# Altium schematic sheet Gate Driver HV.SchDoc
size A2
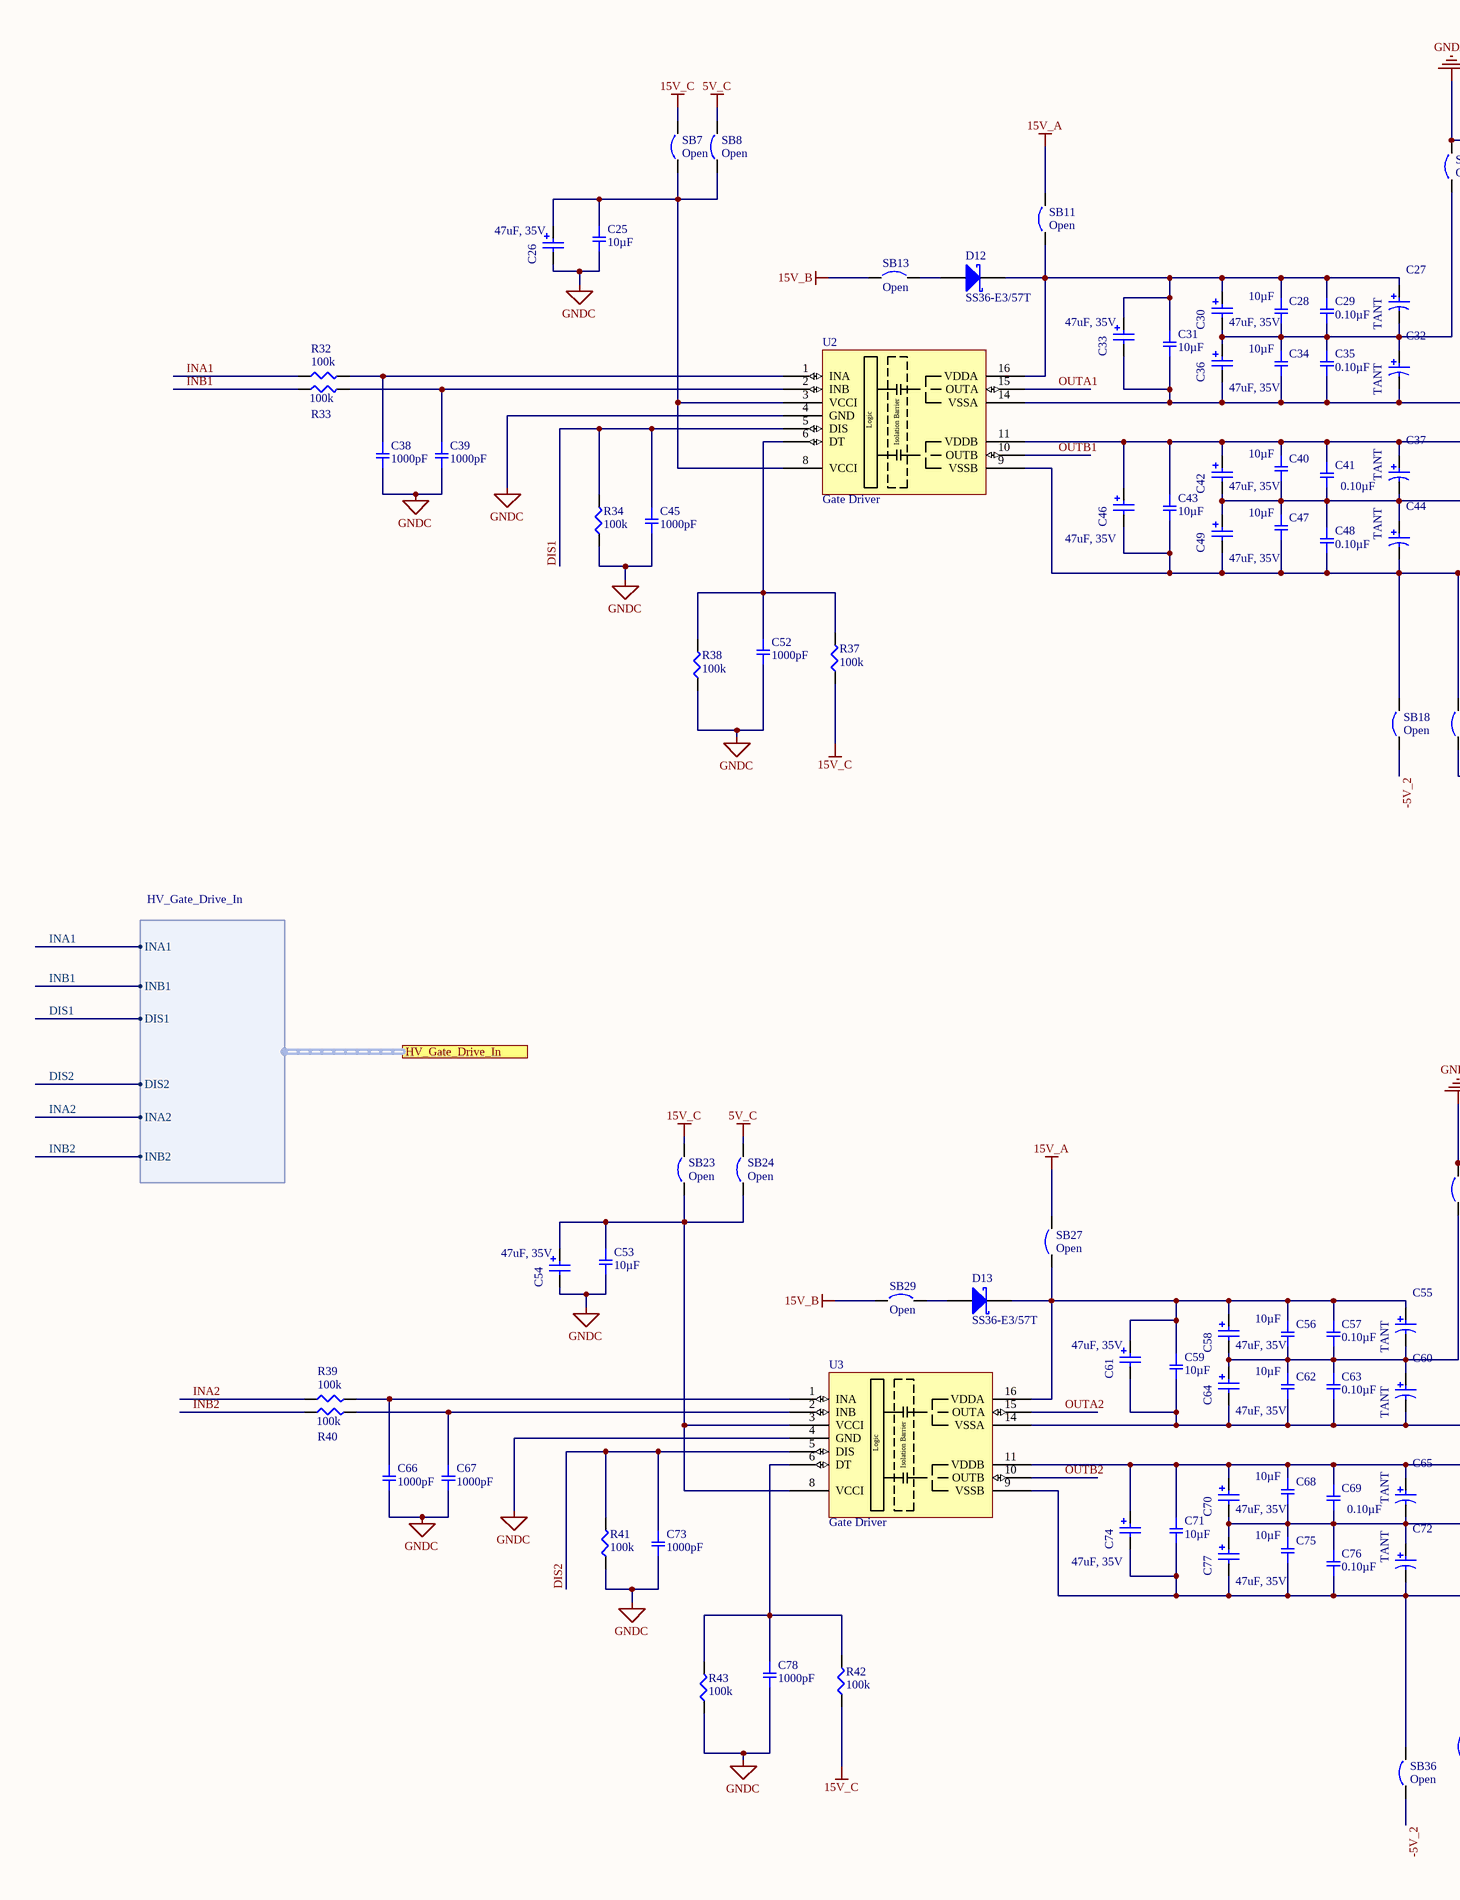
[diagram p0: Gate Driver HV.SchDoc, left]
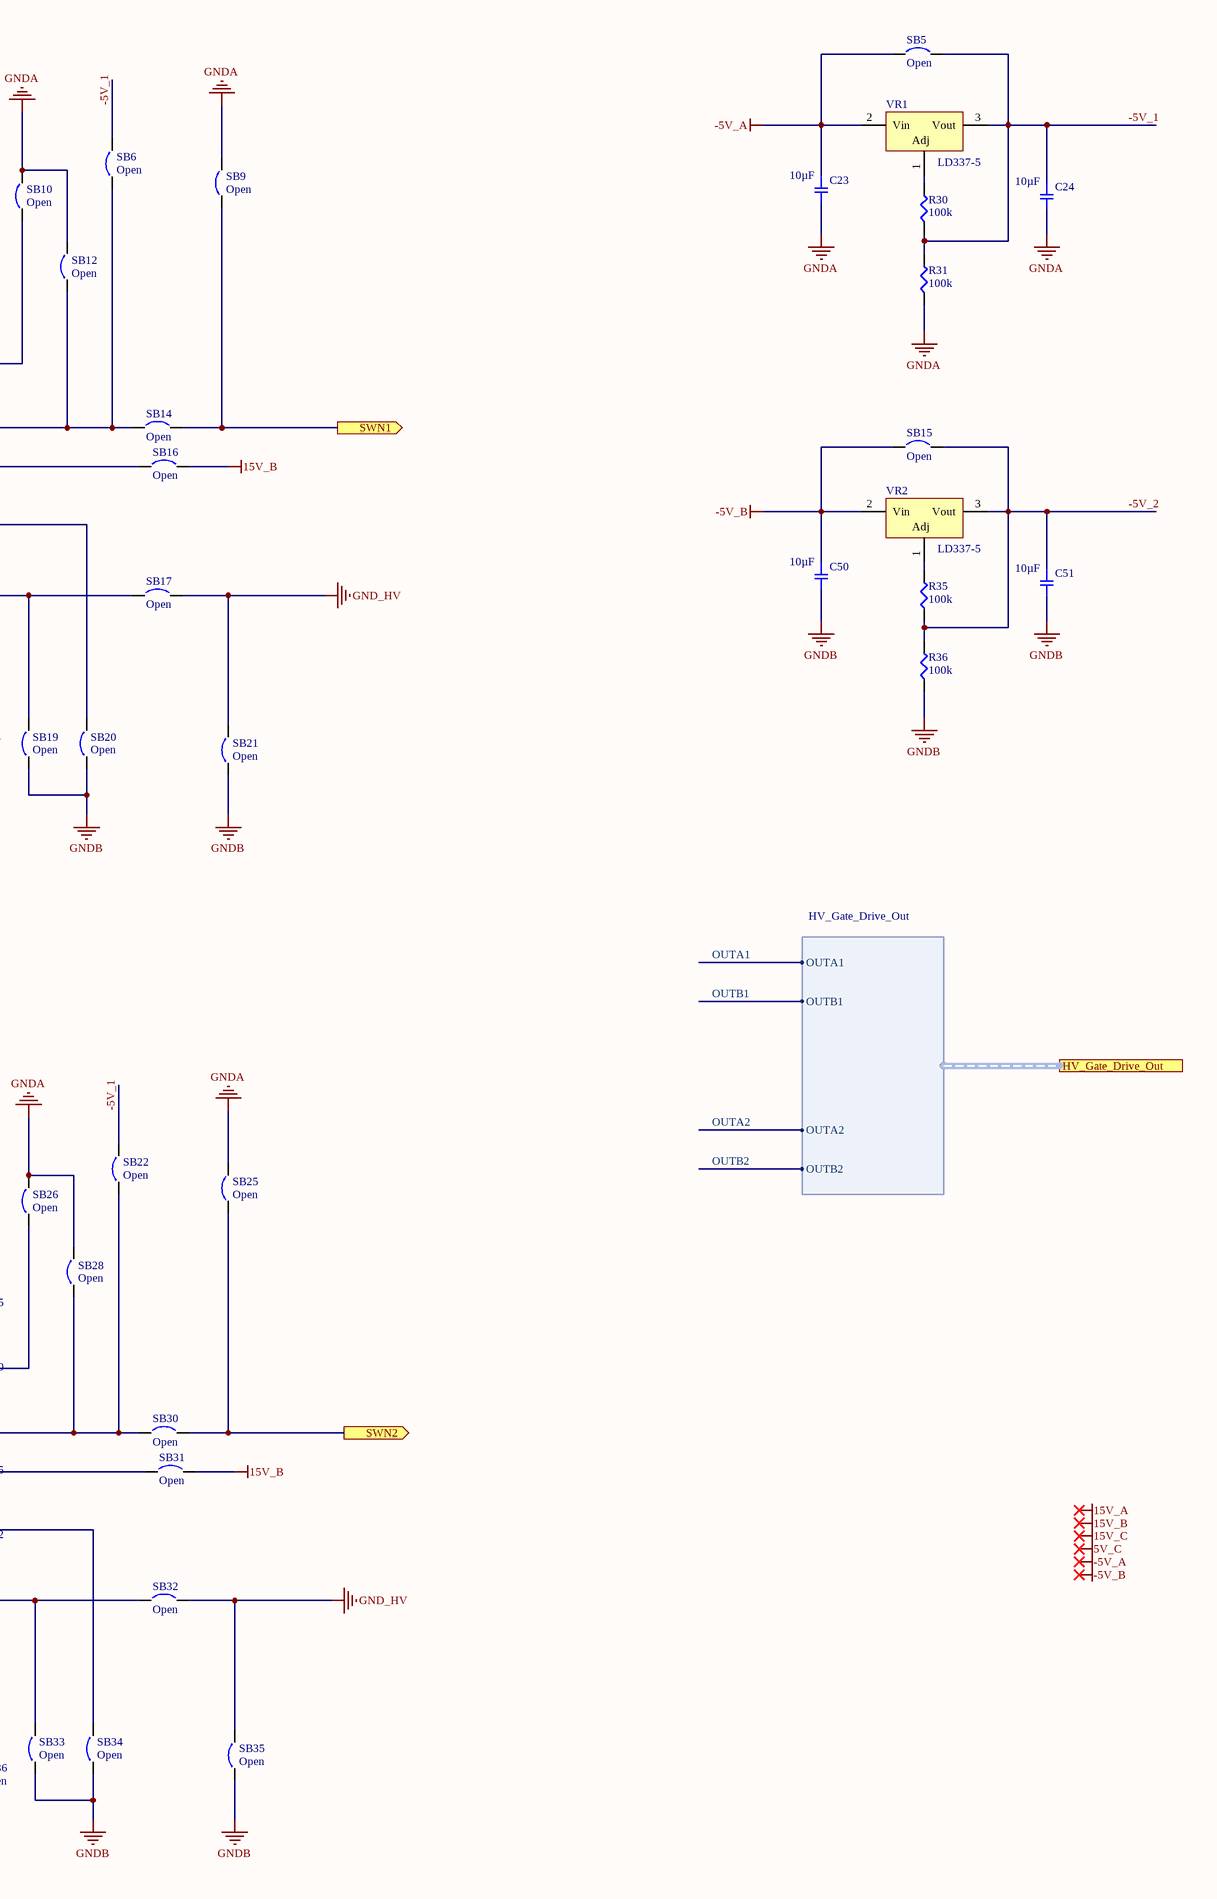
[diagram p1: Gate Driver HV.SchDoc, right]

## Parts
C23  10µF  [SMD-1206C]
C24  10µF  [SMD-1206C]
C25  10µF  [SMD-1206C]
C26  47uF, 35V  [WCAP-ASLL_6.3x5.5]
C27  TANT  [KEMT-T491-D_L]
C28  10µF  [SMD-1206C]
C29  0.10µF  [SMD-1206C]
C30  47uF, 35V  [WCAP-ASLL_6.3x5.5]
C31  10µF  [SMD-1206C]
C32  TANT  [KEMT-T491-D_L]
C33  47uF, 35V  [WCAP-ASLL_6.3x5.5]
C34  10µF  [SMD-1206C]
C35  0.10µF  [SMD-1206C]
C36  47uF, 35V  [WCAP-ASLL_6.3x5.5]
C37  TANT  [KEMT-T491-D_L]
C38  1000pF  [SMD-0805C]
C39  1000pF  [SMD-0805C]
C40  10µF  [SMD-1206C]
C41  0.10µF  [SMD-1206C]
C42  47uF, 35V  [WCAP-ASLL_6.3x5.5]
C43  10µF  [SMD-1206C]
C44  TANT  [KEMT-T491-D_L]
C45  1000pF  [SMD-0805C]
C46  47uF, 35V  [WCAP-ASLL_6.3x5.5]
C47  10µF  [SMD-1206C]
C48  0.10µF  [SMD-1206C]
C49  47uF, 35V  [WCAP-ASLL_6.3x5.5]
C50  10µF  [SMD-1206C]
C51  10µF  [SMD-1206C]
C52  1000pF  [SMD-0805C]
C53  10µF  [SMD-1206C]
C54  47uF, 35V  [WCAP-ASLL_6.3x5.5]
C55  TANT  [KEMT-T491-D_L]
C56  10µF  [SMD-1206C]
C57  0.10µF  [SMD-1206C]
C58  47uF, 35V  [WCAP-ASLL_6.3x5.5]
C59  10µF  [SMD-1206C]
C60  TANT  [KEMT-T491-D_L]
C61  47uF, 35V  [WCAP-ASLL_6.3x5.5]
C62  10µF  [SMD-1206C]
C63  0.10µF  [SMD-1206C]
C64  47uF, 35V  [WCAP-ASLL_6.3x5.5]
C65  TANT  [KEMT-T491-D_L]
C66  1000pF  [SMD-0805C]
C67  1000pF  [SMD-0805C]
C68  10µF  [SMD-1206C]
C69  0.10µF  [SMD-1206C]
C70  47uF, 35V  [WCAP-ASLL_6.3x5.5]
C71  10µF  [SMD-1206C]
C72  TANT  [KEMT-T491-D_L]
C73  1000pF  [SMD-0805C]
C74  47uF, 35V  [WCAP-ASLL_6.3x5.5]
C75  10µF  [SMD-1206C]
C76  0.10µF  [SMD-1206C]
C77  47uF, 35V  [WCAP-ASLL_6.3x5.5]
C78  1000pF  [SMD-0805C]
D12  SS36-E3/57T  [VISH-DO-214AB-2_V]
D13  SS36-E3/57T  [VISH-DO-214AB-2_V]
R30  100k  [SMD-0805-RES]
R31  100k  [SMD-0805-RES]
R32  100k  [SMD-0805-RES]
R33  100k  [SMD-0805-RES]
R34  100k  [SMD-0805-RES]
R35  100k  [SMD-0805-RES]
R36  100k  [SMD-0805-RES]
R37  100k  [SMD-0805-RES]
R38  100k  [SMD-0805-RES]
R39  100k  [SMD-0805-RES]
R40  100k  [SMD-0805-RES]
R41  100k  [SMD-0805-RES]
R42  100k  [SMD-0805-RES]
R43  100k  [SMD-0805-RES]
SB5  Open  [SB_0603]  (no BOM)
SB6  Open  [SB_0603]  (no BOM)
SB7  Open  [SB_0603]  (no BOM)
SB8  Open  [SB_0603]  (no BOM)
SB9  Open  [SB_0603]  (no BOM)
SB10  Open  [SB_0603]  (no BOM)
SB11  Open  [SB_0603]  (no BOM)
SB12  Open  [SB_0603]  (no BOM)
SB13  Open  [SB_0603]  (no BOM)
SB14  Open  [SB_0603]  (no BOM)
SB15  Open  [SB_0603]  (no BOM)
SB16  Open  [SB_0603]  (no BOM)
SB17  Open  [SB_0603]  (no BOM)
SB18  Open  [SB_0603]  (no BOM)
SB19  Open  [SB_0603]  (no BOM)
SB20  Open  [SB_0603]  (no BOM)
SB21  Open  [SB_0603]  (no BOM)
SB22  Open  [SB_0603]  (no BOM)
SB23  Open  [SB_0603]  (no BOM)
SB24  Open  [SB_0603]  (no BOM)
SB25  Open  [SB_0603]  (no BOM)
SB26  Open  [SB_0603]  (no BOM)
SB27  Open  [SB_0603]  (no BOM)
SB28  Open  [SB_0603]  (no BOM)
SB29  Open  [SB_0603]  (no BOM)
SB30  Open  [SB_0603]  (no BOM)
SB31  Open  [SB_0603]  (no BOM)
SB32  Open  [SB_0603]  (no BOM)
SB33  Open  [SB_0603]  (no BOM)
SB34  Open  [SB_0603]  (no BOM)
SB35  Open  [SB_0603]  (no BOM)
SB36  Open  [SB_0603]  (no BOM)
U2  Gate Driver  [SOIC127P1030X265_HS-17N]
U3  Gate Driver  [SOIC127P1030X265_HS-17N]
VR1  LD337-5  [SOT230P700X180-4N]
VR2  LD337-5  [SOT230P700X180-4N]

## Ports
HV_Gate_Drive_In (harness HV_Gate_Drive_In), HV_Gate_Drive_Out (harness HV_Gate_Drive_Out), SWN1 (out), SWN2 (out)

## Harnesses
HV_Gate_Drive_Out: OUTA1, OUTB1, OUTA2, OUTB2
HV_Gate_Drive_In: INA1, INB1, INA2, INB2, DIS2, DIS1

## Nets
5V_C: SB8.2 SB24.2
15V_A: SB11.2 SB27.2
15V_B: SB13.1 SB16.2 SB29.1 SB31.2
15V_C: R37.1 R42.1 SB7.2 SB23.2
-5V_A: C23.1 SB5.1 VR1.2(Vin)
-5V_B: C50.1 SB15.1 VR2.2(Vin)
GND_HV: SB17.2 SB21.2 SB32.2 SB35.2
GNDA: C23.2 C24.2 R31.1 SB9.2 SB10.2 SB12.2 SB25.2 SB26.2 SB28.2
GNDB: C50.2 C51.2 R36.1 SB19.1 SB20.1 SB21.1 SB33.1 SB34.1 SB35.1
GNDC: C25.2 C26.1(N) C38.2 C39.2 C45.2 C52.2 C53.2 C54.1(N) C66.2 C67.2 C73.2 C78.2 R34.1 R38.1 R41.1 R43.1 U2.4(GND) U3.4(GND)
-5V_1: C24.1 R30.1 R31.2 SB5.2 SB6.2 SB22.2 VR1.3(Vout)
-5V_2: C51.1 R35.1 R36.2 SB15.2 SB18.1 SB36.1 VR2.3(Vout)
DIS1: C45.1 R34.2 U2.5(DIS) ; port HV_Gate_Drive_In.DIS1
DIS2: C73.1 R41.2 U3.5(DIS) ; port HV_Gate_Drive_In.DIS2
INA1: R32.1 ; port HV_Gate_Drive_In.INA1
INA2: R39.1 ; port HV_Gate_Drive_In.INA2
INB1: R33.1 ; port HV_Gate_Drive_In.INB1
INB2: R40.1 ; port HV_Gate_Drive_In.INB2
OUTA1: U2.15(OUTA) ; port HV_Gate_Drive_Out.OUTA1
OUTA2: U3.15(OUTA) ; port HV_Gate_Drive_Out.OUTA2
OUTB1: U2.10(OUTB) ; port HV_Gate_Drive_Out.OUTB1
OUTB2: U3.10(OUTB) ; port HV_Gate_Drive_Out.OUTB2
SWN1: SB9.1 SB14.2 ; port SWN1
SWN2: SB25.1 SB30.2 ; port SWN2
NetC25_1: C25.1 C26.2(P) SB7.1 SB8.1 U2.3(VCCI) U2.8(VCCI)
NetC27_1: C27.1 C28.1 C29.1 C30.2(P) C31.1 C33.2(P) D12.2(K) SB11.1 U2.16(VDDA)
NetC27_2: C27.2 C28.2 C29.2 C30.1(N) C32.1 C34.1 C35.1 C36.2(P) SB10.1
NetC31_2: C31.2 C32.2 C33.1(N) C34.2 C35.2 C36.1(N) SB6.1 SB12.1 SB14.1 U2.14(VSSA)
NetC37_1: C37.1 C40.1 C41.1 C42.2(P) C43.1 C46.2(P) SB16.1 U2.11(VDDB)
NetC37_2: C37.2 C40.2 C41.2 C42.1(N) C44.1 C47.1 C48.1 C49.2(P) SB20.2
NetC38_1: C38.1 R32.2 U2.1(INA)
NetC39_1: C39.1 R33.2 U2.2(INB)
NetC43_2: C43.2 C44.2 C46.1(N) C47.2 C48.2 C49.1(N) SB17.1 SB18.2 SB19.2 U2.9(VSSB)
NetC52_1: C52.1 R37.2 R38.2 U2.6(DT)
NetC53_1: C53.1 C54.2(P) SB23.1 SB24.1 U3.3(VCCI) U3.8(VCCI)
NetC55_1: C55.1 C56.1 C57.1 C58.2(P) C59.1 C61.2(P) D13.2(K) SB27.1 U3.16(VDDA)
NetC55_2: C55.2 C56.2 C57.2 C58.1(N) C60.1 C62.1 C63.1 C64.2(P) SB26.1
NetC59_2: C59.2 C60.2 C61.1(N) C62.2 C63.2 C64.1(N) SB22.1 SB28.1 SB30.1 U3.14(VSSA)
NetC65_1: C65.1 C68.1 C69.1 C70.2(P) C71.1 C74.2(P) SB31.1 U3.11(VDDB)
NetC65_2: C65.2 C68.2 C69.2 C70.1(N) C72.1 C75.1 C76.1 C77.2(P) SB34.2
NetC66_1: C66.1 R39.2 U3.1(INA)
NetC67_1: C67.1 R40.2 U3.2(INB)
NetC71_2: C71.2 C72.2 C74.1(N) C75.2 C76.2 C77.1(N) SB32.1 SB33.2 SB36.2 U3.9(VSSB)
NetC78_1: C78.1 R42.2 R43.2 U3.6(DT)
NetD12_1: D12.1(A) SB13.2
NetD13_1: D13.1(A) SB29.2
NetR30_2: R30.2 VR1.1(Adj)
NetR35_2: R35.2 VR2.1(Adj)

## Notes on the sheet
- Labels drawn without touching a wire or pin: 5V_C, 15V_A, 15V_B, 15V_C, -5V_A, -5V_B
- (in symbol Gate Driver) Logic; Isolation Barrier

## Library data of the parts
C23-C25 C28 C31 C34 C40 C43 C47 C50 C51 C53 C56 C59 C62 C68 C71 C75 = GCJ31CR71A106KA13L: CAP CER 10UF 10V X7R 1206; Manufacturer: Murata Electronics North America; Factory Stock: 0; Unit Price (USD): 0.71; Minimum Quantity: 1; Tolerance: ±10%; Datasheets: http://www.murata.com/~/media/webrenewal/support/library/catalog/products/capacitor/mlcc/c03e.ashx; Image: //media.digikey.com/Renders/Murata%20Renders/GR331BD72E473KW01L.jpg; Digi-Key Part Number: 490-5848-1-ND; Part Number: GCJ31CR71A106KA13L; Quantity Available: 33084; @ qty: 0; Packaging: Cut Tape (CT); Series: GCJ; Part Status: Active; Value: 10µF; Voltage: 10V; Temperature Coefficient: X7R; Operating Temperature: -55°C ~ 125°C; Features: Soft Termination; Ratings: AEC-Q200; Applications: Automotive, Boardflex Sensitive; Mounting Type: Surface Mount, MLCC; Package / Case: 1206 (3216 Metric); Size / Dimension: 0.126" L x 0.063" W (3.20mm x 1.60mm); Height - Seated (Max): -; Thickness (Max): 0.063" (1.60mm); Lead Spacing: -; Lead Style: -
C26 C30 C33 C36 C42 C46 C49 C54 C58 C61 C64 C70 C74 C77 = 865060543005: WCAP-ASLL SMT Aluminum Electrolytic Capacitors, D6.3mm x L5.5mm, 47uF, +/-20%, 35VDC; Dissipation Factor: 14%; Endurance: 2000h; Leakage Current: 16.45uA; Ripple Current max.: 240mA; Technical Reference: ASED055470M035DVCTBB000; ComponentLink1Description: Manufacturer; ComponentLink1URL: http://www.we-online.de; ComponentLink2Description: Datasheet; ComponentLink2URL: https://katalog.we-online.com/pbs/datasheet/865060543005.pdf; Length: 5.5mm; Mounting Technology: SMT; Operating Temperature: -55 to +105degC; Packaging: Tape and Reel; Published Date: August 2019; Capacitance: 47uF; Diameter: 6.3mm; Part Number: 865060543005; Publisher: Wurth Elektronik; Capacitance Tolerance: +/-20%; Rated Voltage: 35VDC
C27 C32 C37 C44 C55 C60 C65 C72 = CMP-2000-07580-1: Tantalum Capacitor, 10 uF, +/- 10%, 35 V, -55 to 125 degC, 2-Pin SMD, RoHS, Tape and Reel; Manufacturer: Kemet; Capacitance: 10uF; Leakage Current: 3.5uA; Dissipation Factor: 6%; Case\/Package: 2917; Polarity: Polar; Voltage Rating: 35V; ESR (Equivalent Series Resistance): 1Ohm; Life (Hours): 2000Hour; Tolerance: 20%; Max Operating Temperature: 125degC; Length: 7.3mm; Depth: 4.3mm; Termination: SMD/SMT; Case Code (Metric): 7343; Number of Pins: 2; Package Reference: T491-D; Width: 4.3mm; RoHSCompliant: True; Lead Free: LeadFree; Radiation Hardening: No; Height: 2.8mm; Voltage Rating (DC): 35V; REACH SVHC: NoSVHC; Datasheet URL: http://www.kemet.com/Lists/ProductCatalog/Attachments/254/KEM_T2005_T491.pdf; Datasheet Version: 07/2017; Manufacturer URL: http://www.kemet.com/; Mounting Technology: SurfaceMount; Min Operating Temperature: -55degC; Case Code (Imperial): 2917; Package Quantity: 1; Packaging: TapeandReel; Package Description: 2-Pin Surface Mount Device, Body 7.3 x 4.3 mm; Height - Seated (Max): 0.122inch; Voltage: 35V; Dielectric Material: Tantalum; Mount: PCB
C29 C35 C41 C48 C57 C63 C69 C76 = GCJ31CR72E104KXJ3L: CAP CER 0.1UF 250V X7R 1206; Manufacturer: Murata Electronics North America; Factory Stock: 0; Unit Price (USD): 0.36; Minimum Quantity: 1; Tolerance: ±10%; Datasheets: http://www.murata.com/~/media/webrenewal/support/library/catalog/products/capacitor/mlcc/c03e.ashx; Image: //media.digikey.com/Renders/Murata%20Renders/GR331BD72E473KW01L.jpg; Digi-Key Part Number: 490-12647-1-ND; Part Number: GCJ31CR72E104KXJ3L; Quantity Available: 3645; @ qty: 0; Packaging: Cut Tape (CT); Series: GCJ; Part Status: Active; Value: 0.10µF; Voltage: 250V; Temperature Coefficient: X7R; Operating Temperature: -55°C ~ 125°C; Features: Soft Termination; Ratings: AEC-Q200; Applications: Automotive, Boardflex Sensitive; Mounting Type: Surface Mount, MLCC; Package / Case: 1206 (3216 Metric); Size / Dimension: 0.126" L x 0.063" W (3.20mm x 1.60mm); Height - Seated (Max): -; Thickness (Max): 0.071" (1.80mm); Lead Spacing: -; Lead Style: -
C38 C39 C45 C52 C66 C67 C73 C78 = GCJ216R72A102KA01D: CAP CER 1000PF 100V X7R 0805; Manufacturer: Murata Electronics North America; Factory Stock: 0; Unit Price (USD): 0.25; Minimum Quantity: 1; Tolerance: ±10%; Datasheets: http://www.murata.com/~/media/webrenewal/support/library/catalog/products/capacitor/mlcc/c03e.ashx; Image: //media.digikey.com/Renders/Murata%20Renders/0805%20(2012%20Metric)%20.85mm.jpg; Digi-Key Part Number: 490-5818-1-ND; Part Number: GCJ216R72A102KA01D; Quantity Available: 9725; @ qty: 0; Packaging: Cut Tape (CT); Series: GCJ; Part Status: Active; Value: 1000pF; Voltage: 100V; Temperature Coefficient: X7R; Operating Temperature: -55°C ~ 125°C; Features: Soft Termination; Ratings: AEC-Q200; Applications: Automotive, Boardflex Sensitive; Mounting Type: Surface Mount, MLCC; Package / Case: 0805 (2012 Metric); Size / Dimension: 0.079" L x 0.049" W (2.00mm x 1.25mm); Height - Seated (Max): -; Thickness (Max): 0.024" (0.60mm); Lead Spacing: -; Lead Style: -
D12 D13 = CMP-2000-07150-1: Surface Mount Schottky Barrier Rectifier, 60 V, 3 A, -55 to 150 degC, 2-Pin SMC (DO-214AB), RoHS, Tape and Reel; Manufacturer: Vishay; Forward Current If(AV): 3A; Diode Configuration: Single; Forward Surge Current Ifsm Max: 100A; SVHC: ToBeAdvised; No. of Pins: 2Pins; Forward Voltage VF Max: 750mV; Repetitive Reverse Voltage Vrrm Max: 60V; Datasheet URL: http://www.vishay.com/docs/88751/ss32.pdf; Datasheet Version: 08/2015; Manufacturer URL: http://www.vishay.com/; Diode Type: Schottky; Package Reference: DO-214AB; Mounting Technology: SurfaceMount; Diode Case Style: DO-214AB; Package Description: 2-Pin Surface Mount Device, Body 6.855 x 5.905 mm; Packaging: CutTape; Operating Temperature Max: 150°C; Product Range: -
R30-R43 = ERJ-6ENF1003V: RES SMD 100K OHM 1% 1/8W 0805; Manufacturer: Panasonic Electronic Components; Factory Stock: 0; Unit Price (USD): 0.00729; @ qty: 1500; Minimum Quantity: 1; Power (Watts): 0.125W, 1/8W; Temperature Coefficient: ±100ppm/°C; Part Number: ERJ-6ENF1003V; Datasheets: http://industrial.panasonic.com/www-cgi/jvcr13pz.cgi?E+PZ+3+AOA0002+ERJ6ENF1003V+7+WW; Image: //media.digikey.com/Renders/Panasonic%20Renders/ERJ-0805%20Pkg.jpg; Digi-Key Part Number: P100KCCT-ND; Quantity Available: 760677; Packaging: Cut Tape (CT); Series: ERJ; Part Status: Active; Value: 100k; Tolerance: ±1%; Composition: Thick Film; Features: Automotive AEC-Q200; Operating Temperature: -55°C ~ 155°C; Package / Case: 0805 (2012 Metric); Supplier Device Package: 0805; Size / Dimension: 0.079" L x 0.049" W (2.00mm x 1.25mm); Height - Seated (Max): 0.028" (0.70mm); Number of Terminations: 2; Failure Rate: -
SB5-SB36 = Solder Bridge: Circuit Breaker; Published: 24-Mar-1999; Revision: July-2002: Re-released for DXP Platform.; Publisher: Altium Limited
VR1 VR2 = LM337-Negative_Adj: Voltage Regulator; Published: 24-Mar-1999; LatestRevisionDate: 29-May-2009; LatestRevisionNote: IPC-7351 Footprint Added.; PackageReference: D2PAK; Publisher: Altium Limited; PackageDescription: 3-Pin Transistor Outline Package 2.54 mm Pitch, 15.1 mm Lead Span